# Altium schematic sheet [00]-Smart_Door.SchDoc
size A4; Organization: Indruino Co., Ltd; Address1: No. 1, Vo Van Ngan Street; Address2: Thu Duc District, HCMC; SheetNumber: 1; SheetTotal: 9
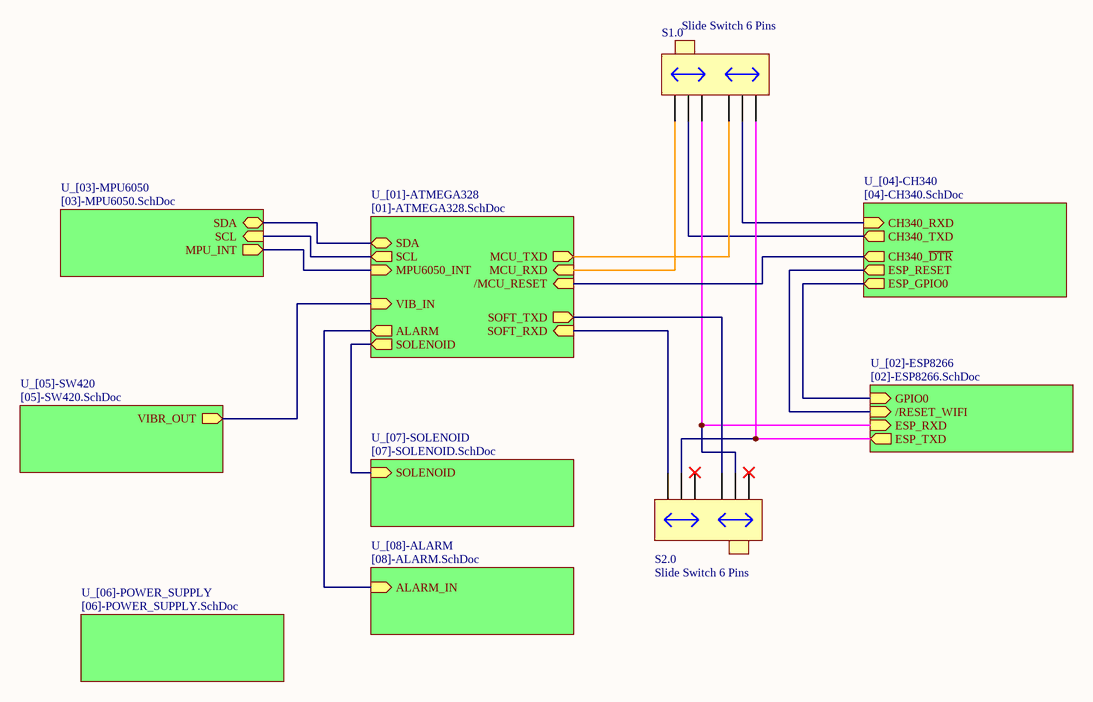
[diagram p0: [00]-Smart_Door.SchDoc]

## Parts
S1.0  Slide Switch 6 Pins  [SW6_MSS-22D18]
S2.0  Slide Switch 6 Pins  [SW6_MSS-22D18]

## Sub-sheets
U_[01]-ATMEGA328 = [01]-ATMEGA328.SchDoc: MCU_TXD (out), MCU_RXD (in), ALARM (out), SCL (out), SDA (bidir), SOLENOID (out), VIB_IN (in), SOFT_RXD (in), SOFT_TXD (out), MPU6050_INT (in), /MCU_RESET (in)
U_[02]-ESP8266 = [02]-ESP8266.SchDoc: GPIO0 (in), ESP_TXD (out), ESP_RXD (in), /RESET_WIFI (in)
U_[03]-MPU6050 = [03]-MPU6050.SchDoc: SDA (bidir), SCL (in), MPU_INT (out)
U_[04]-CH340 = [04]-CH340.SchDoc: CH340_TXD (out), CH340_RXD (in), ESP_RESET (out), ESP_GPIO0 (out), CH340_~{DTR} (out)
U_[05]-SW420 = [05]-SW420.SchDoc: VIBR_OUT (out)
U_[06]-POWER_SUPPLY = [06]-POWER_SUPPLY.SchDoc: no entries
U_[07]-SOLENOID = [07]-SOLENOID.SchDoc: SOLENOID (in)
U_[08]-ALARM = [08]-ALARM.SchDoc: ALARM_IN (in)

## Nets
NetS1.0_1: S1.0.1(NC) ; sheet U_[01]-ATMEGA328/MCU_RXD
NetS1.0_2: S1.0.2(NC) ; sheet U_[01]-ATMEGA328/MCU_TXD
NetS1.0_3: S1.0.3(COM) ; sheet U_[04]-CH340/CH340_TXD
NetS1.0_4: S1.0.4(COM) ; sheet U_[04]-CH340/CH340_RXD
NetS1.0_5: S1.0.5(NO) S2.0.3(COM) ; sheet U_[02]-ESP8266/ESP_RXD
NetS1.0_6: S1.0.6(NO) S2.0.4(COM) ; sheet U_[02]-ESP8266/ESP_TXD
NetS2.0_5: S2.0.5(NO) ; sheet U_[01]-ATMEGA328/SOFT_TXD
NetS2.0_6: S2.0.6(NO) ; sheet U_[01]-ATMEGA328/SOFT_RXD
(unnamed): sheet U_[01]-ATMEGA328/ALARM, sheet U_[08]-ALARM/ALARM_IN
(unnamed): sheet U_[01]-ATMEGA328/SCL, sheet U_[03]-MPU6050/SCL
(unnamed): sheet U_[01]-ATMEGA328/SDA, sheet U_[03]-MPU6050/SDA
(unnamed): sheet U_[01]-ATMEGA328/SOLENOID, sheet U_[07]-SOLENOID/SOLENOID
(unnamed): sheet U_[01]-ATMEGA328/VIB_IN, sheet U_[05]-SW420/VIBR_OUT
(unnamed): sheet U_[01]-ATMEGA328/MPU6050_INT, sheet U_[03]-MPU6050/MPU_INT
(unnamed): sheet U_[01]-ATMEGA328//MCU_RESET, sheet U_[04]-CH340/CH340_~{DTR}
(unnamed): sheet U_[02]-ESP8266/GPIO0, sheet U_[04]-CH340/ESP_GPIO0
(unnamed): sheet U_[02]-ESP8266//RESET_WIFI, sheet U_[04]-CH340/ESP_RESET

Not connected (* = marked no-connect by the designer): S2.0 1(NC)* 2(NC)*

## Notes on the sheet
- Title
- Size:
- Date:
- Author:
- A4
- Time:
- Number:
- Checked:
- Revision:
- Sheet
- Approved:
- of
- File:

## Library data of the parts
S1.0 S2.0 = Slide Switch 6 Pins: Switch; Published: 24-Mar-1999; LatestRevisionDate: 17-Jul-2002; LatestRevisionNote: Re-released for DXP Platform.; PackageReference: SPST-2; Publisher: Altium Limited